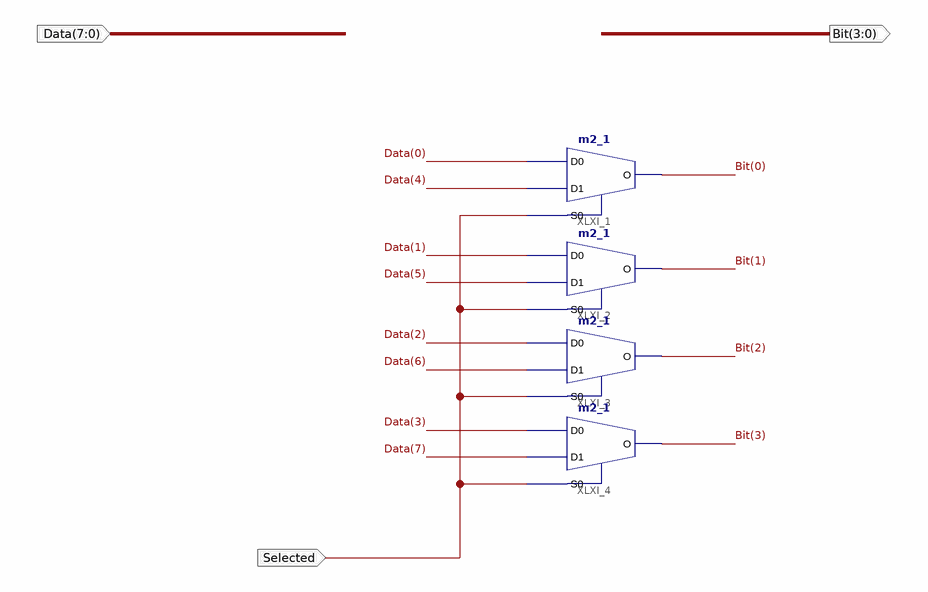
[diagram p0: schematic sheet 1]
// Xilinx ISE schematic Mux.sch (spartan6) as structural Verilog: 4 symbols, 3 ports
module Mux (
  input  Selected,
  input  [7:0] Data,
  output [3:0] Bit
);

  m2_1 XLXI_1 (.D0(Data[0]), .D1(Data[4]), .S0(Selected), .O(Bit[0]));
  m2_1 XLXI_2 (.D0(Data[1]), .D1(Data[5]), .S0(Selected), .O(Bit[1]));
  m2_1 XLXI_3 (.D0(Data[2]), .D1(Data[6]), .S0(Selected), .O(Bit[2]));
  m2_1 XLXI_4 (.D0(Data[3]), .D1(Data[7]), .S0(Selected), .O(Bit[3]));
endmodule
